# EAGLE design rapidshark-main-breakout-bottom-mk-1.1 (EAGLE 6.5.0)
AUTHOR: sean@yak.net
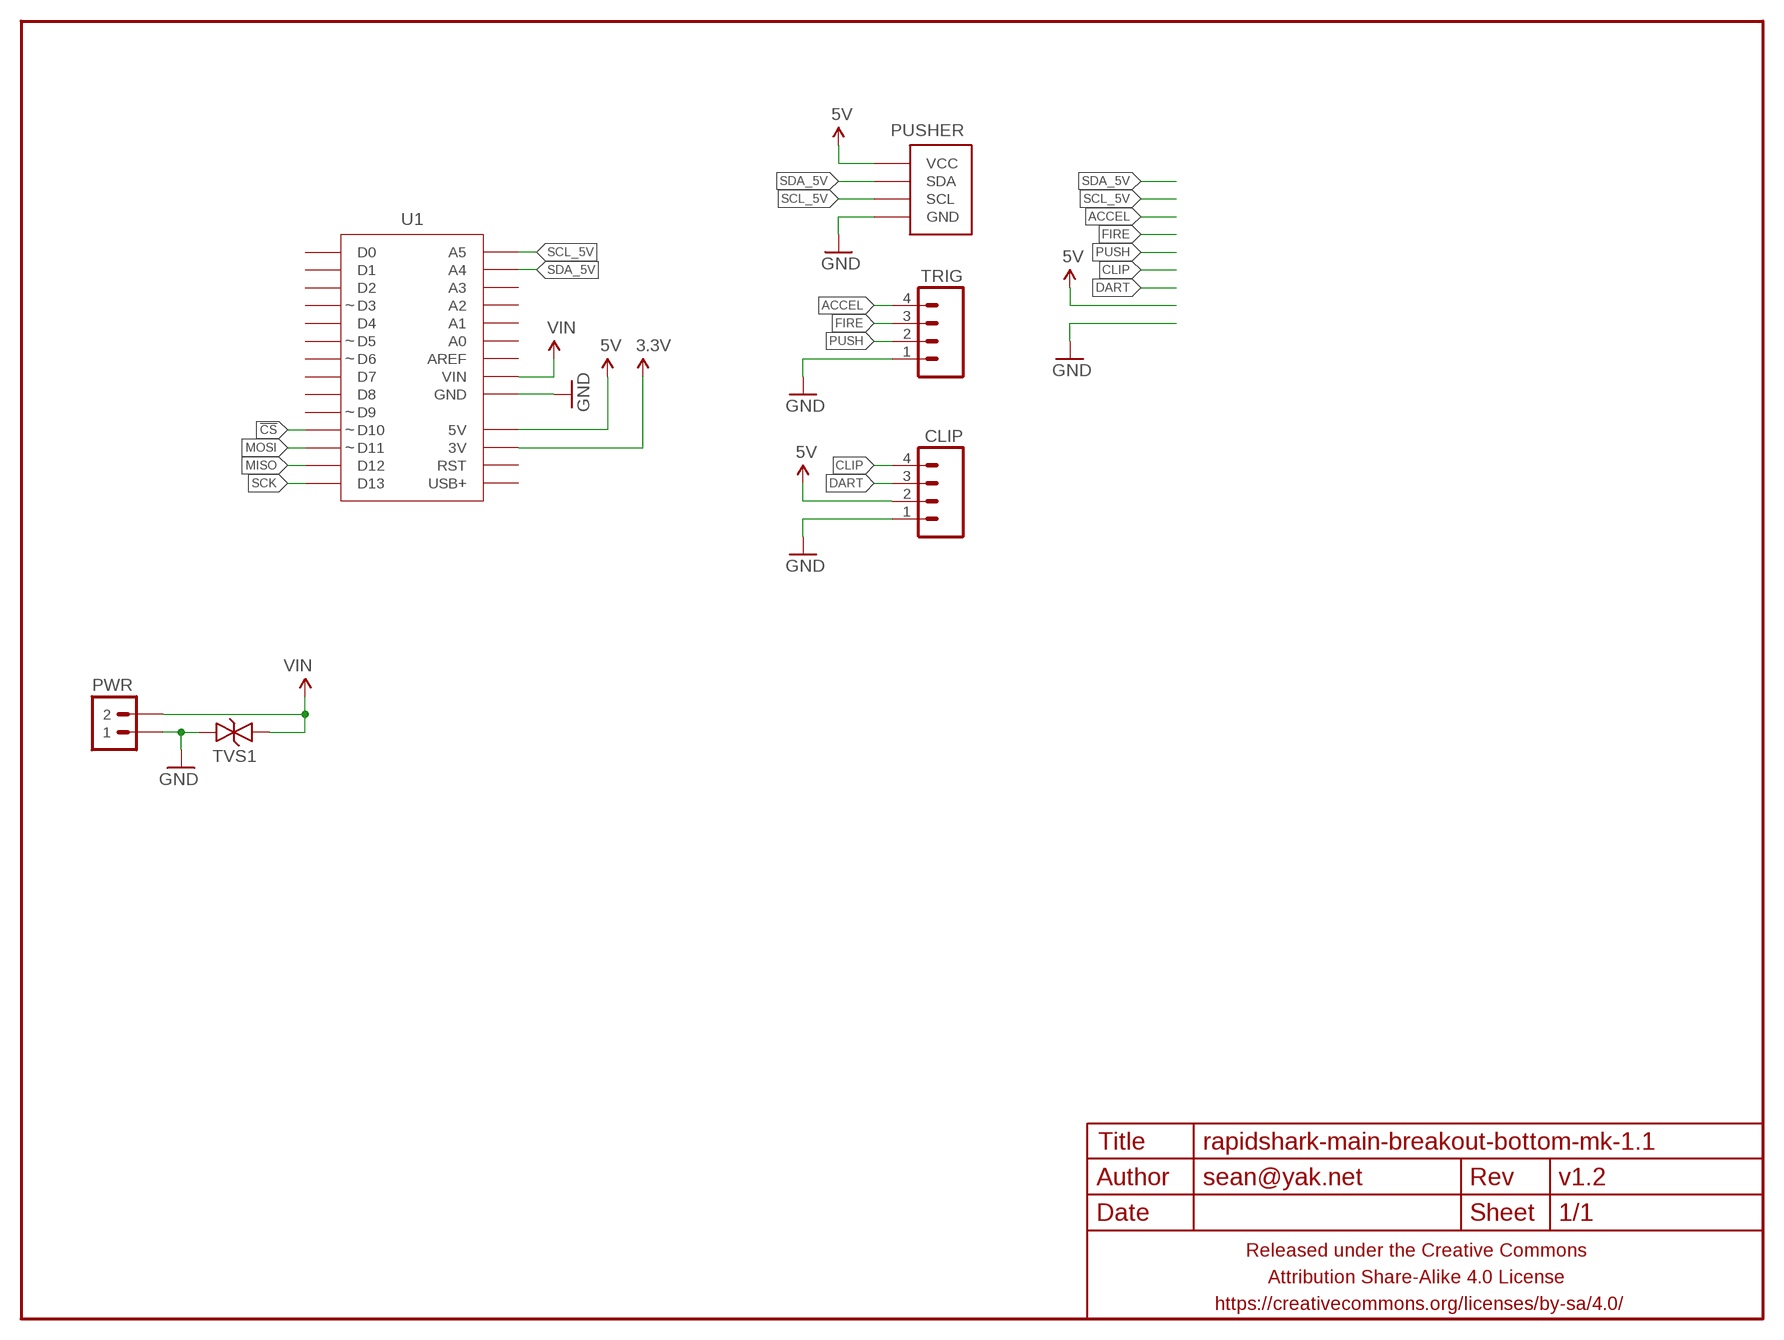
[diagram p0: schematic, sheet 1]

## Parts
CLIP  M04JST-PTH-VERT  [JST-4-PH-VERT-PTH]
FRAME1  FRAME-LETTERNO_PACKAGE  [DUMMY]
PUSHER  M04-I2CJST-4-PH-VERT-NS  [JST-4-PH-VERT-PTH]
PWR  M02PTH-CENTERED-R+  [1X02-CENTER-R+]
TRIG  M04JST-PTH-VERT  [JST-4-PH-VERT-PTH]
TVS1  TVSDO-41-10.16MM  [DO-41-TVS-BI-10.16MM]
U1  ADAFRUIT_METRO_MININOHOLES-OUTSIDER  [ADAFRUIT_METRO_MINI_OUTSIDER]

## Nets
3.3V: U1.17(3V)
5V: CLIP.2 PUSHER.2(VCC) U1.18(5V)
!CS: U1.11(D10)
ACCEL: TRIG.4
CLIP: CLIP.4
DART: CLIP.3
FIRE: TRIG.3
GND: CLIP.1 PUSHER.1(GND) PWR.1 TRIG.1 TVS1.P$1 U1.19(GND) U1.20(GND)
MISO: U1.13(D12)
MOSI: U1.12(D11)
PUSH: TRIG.2
SCK: U1.14(D13)
SCL_5V: PUSHER.4(SCL) U1.28(A5)
SDA_5V: PUSHER.3(SDA) U1.27(A4)
VIN: PWR.2 TVS1.P$2 U1.21(VIN)
Unconnected: U1.1(D0) U1.2(D1) U1.3(D2) U1.4(D3) U1.5(D4) U1.6(D5) U1.7(D6) U1.8(D7) U1.9(D8) U1.10(D9) U1.15(USB+) U1.16(RST) U1.22(AREF) U1.23(A0) U1.24(A1) U1.25(A2) U1.26(A3)

## Library data of the parts
CLIP TRIG = A_butts:M04: Header 4 Standard 4-pin 0.1" header. Use with straight break away headers (SKU : PRT-00116), right angle break away headers (PRT-00553), swiss pins (PRT-00743), machine pins (PRT-00117), and female headers (PRT-00115). Molex polarized connector foot print use with SKU : PRT-08231 with associated crimp pins and housings. 1MM SMD Version SKU: PRT-10208
FRAME1 = A_butts:FRAME-LETTER: Schematic Frame Standard 8.5x11 US Letter frame; DESIGNER: sean@yak.net; VERSION: v1.2
PUSHER = A_butts:M04-I2C
PWR = A_butts:M02: Standard 2-pin 0.1" header. Use with - straight break away headers ( PRT-00116) - right angle break away headers (PRT-00553) - swiss pins (PRT-00743) - machine pins (PRT-00117) - female headers (PRT-00115) Molex polarized connector foot print use with: PRT-08233 with associated crimp pins and housings. 2.54_SCREWTERM for use with PRT-10571. 3.5mm Screw Terminal footprints for PRT-08084 5mm Screw Terminal footprints for use with PRT-08433
TVS1 = A_butts:TVS: Transient voltage suppressor- prevents ESD on inputs. Ignore package description- MBRA140 is NOT this type of part!!!
U1 = A_butts:ADAFRUIT_METRO_MINI

## Board
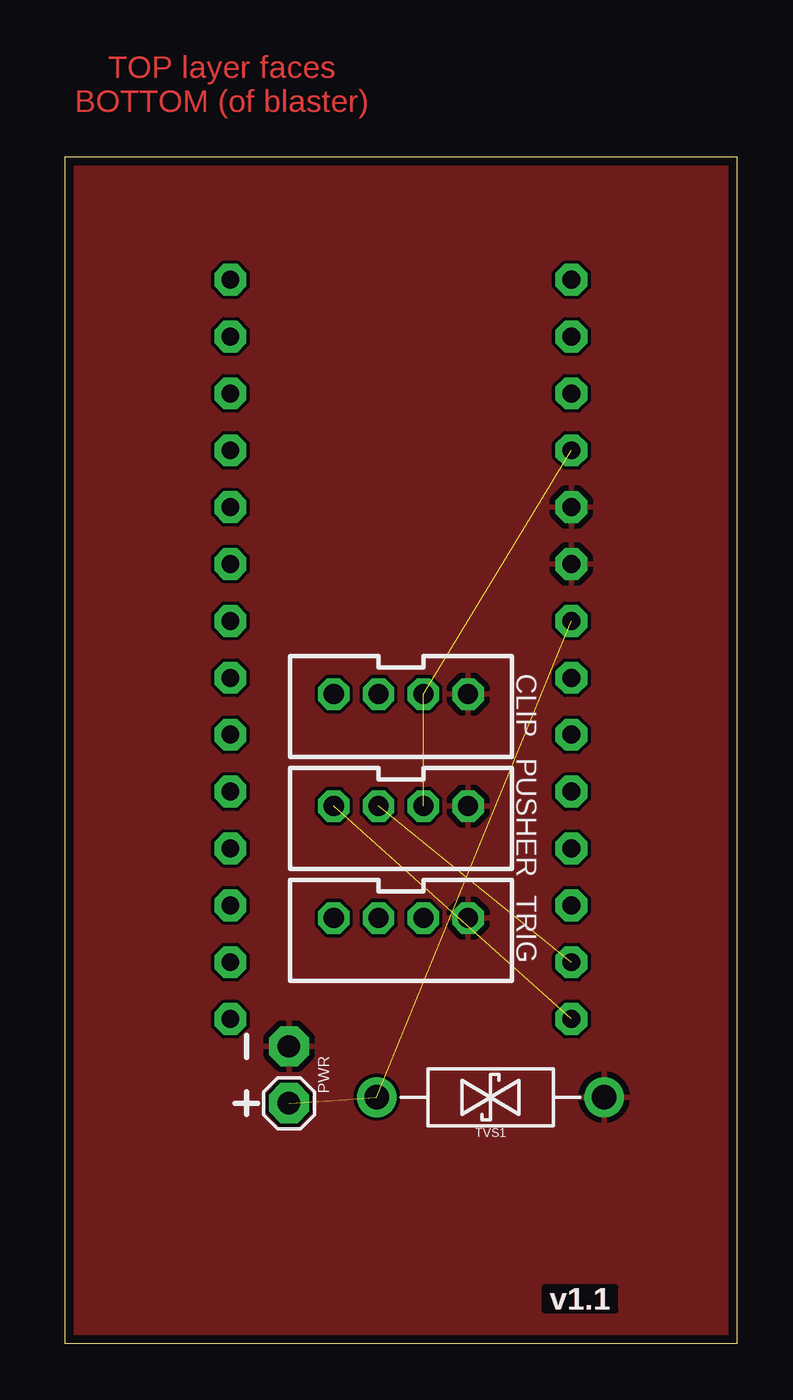
[diagram p1: board, top side]
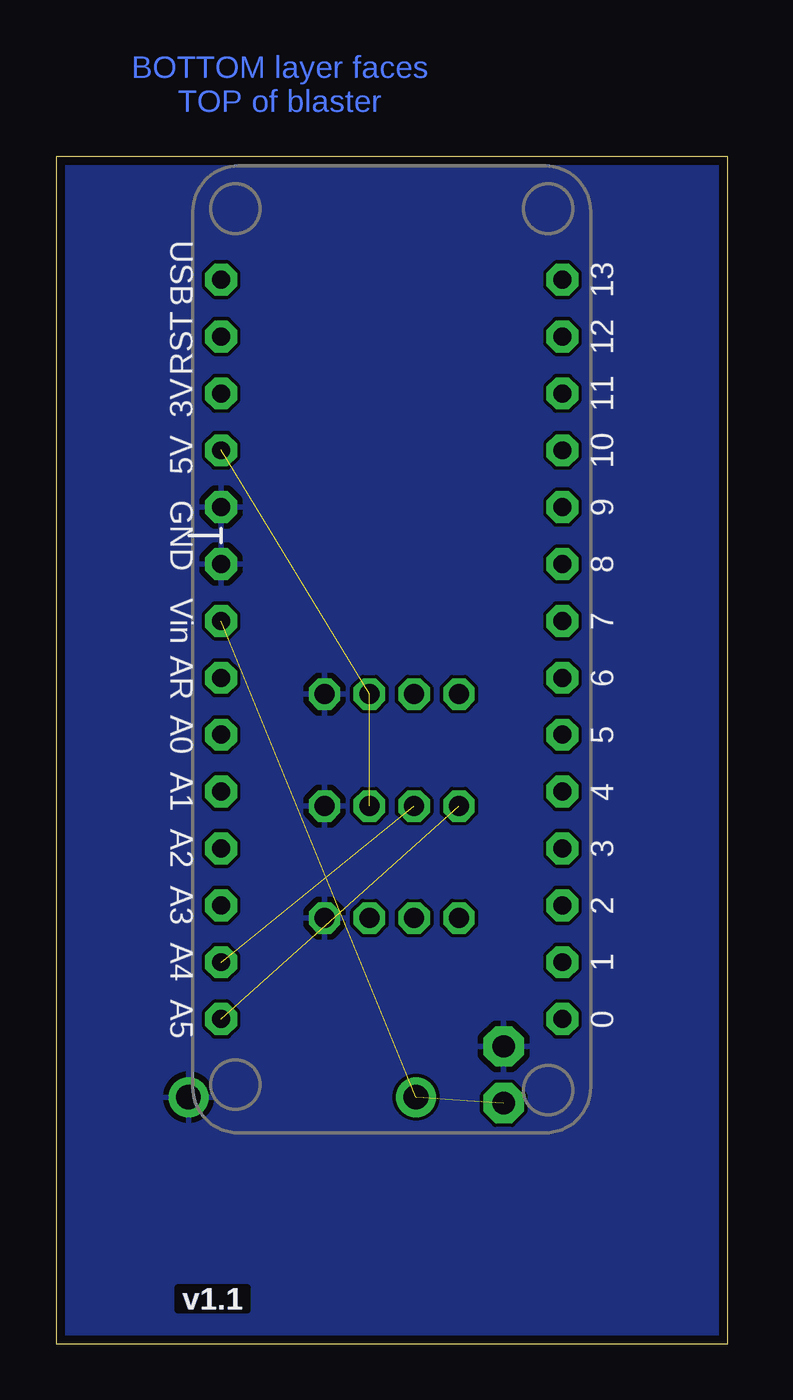
[diagram p2: board, bottom side, seen from below]

Size 30 x 53 mm. Coordinates in mm from the lower left corner, seen from the top.
Outline: 30,0 0,0 0,53 30,53 30,0
Copper layers (1*16): Top 0.0356mm / dielectric 1.5011mm / Bottom 0.0356mm
Design rules "LaenPCBOrder_2": minimum track width 6mil, minimum drill 13mil, track to track 6mil, track to pad 6mil, pad to pad 6mil, via to via 6mil, smd to smd 6mil, copper to edge 15mil, drill to drill 6mil, minimum pad ring 7mil, minimum via ring 7mil, stop-mask expansion 3mil, vias tented up to drill 20mil, thermal gap 10mil

### Footprints (pad centres in the part's own frame; a part is rotated, then mirrored left to right if it is on the bottom)
JST-4-PH-VERT-PTH = drill 0.9 pad 1.4 octagon: 1 0,0; 2 2,0; 3 4,0; 4 6,0
1X02-CENTER-R+ = drill 1 pad 1.8 octagon: 1 -1.27,0; 2 1.27,0
DO-41-TVS-BI-10.16MM = drill 1.1 pad 1.778: P$1 -5.08,0; P$2 5.08,0
ADAFRUIT_METRO_MINI_OUTSIDER = drill 0.8 pad 1.422 octagon: 1 16.51,7.62; 2 13.97,7.62; 3 11.43,7.62; 4 8.89,7.62; 5 6.35,7.62; 6 3.81,7.62; 7 1.27,7.62; 8 -1.27,7.62; 9 -3.81,7.62; 10 -6.35,7.62; 11 -8.89,7.62; 12 -11.43,7.62; 13 -13.97,7.62; 14 -16.51,7.62; 15 -16.51,-7.62; 16 -13.97,-7.62; 17 -11.43,-7.62; 18 -8.89,-7.62; 19 -6.35,-7.62; 20 -3.81,-7.62; 21 -1.27,-7.62; 22 1.27,-7.62; 23 3.81,-7.62; 24 6.35,-7.62; 25 8.89,-7.62; 26 11.43,-7.62; 27 13.97,-7.62; 28 16.51,-7.62

### Placement (x,y rotation side)
CLIP  18,29 180 top
FRAME1  0,0 0 bottom
PUSHER  18,24 180 top
PWR  10,12 270 top
TRIG  18,19 180 top
TVS1  19,11 180 top
U1  15,31 270 bottom

### Tracks (layer width: path | path; a pad name or v marks a point on that pad's centre or on a via)
5V  (2 unrouted)
GND
  pour Top (rank 6): 0,0 0,53 30,53 30,0
  pour Bottom (rank 6): 0,0 0,53 30,53 30,0
SCL_5V  (1 unrouted)
SDA_5V  (1 unrouted)
VIN  (2 unrouted)

### Text on the board
Top: TOP layer faces / BOTTOM (of blaster)
Bottom: BOTTOM layer faces / TOP of blaster
Reference: BARREL | RIGHT / main assembly | LEFT / shell cover | BUTT
tDocu: TOP layer faces / BOTTOM (of blaster)
bDocu: BOTTOM layer faces / TOP of blaster